# Altium schematic sheet Solar Batter Charger SCH_2.SchDoc
size A3; SheetNumber: 3; SheetTotal: 3
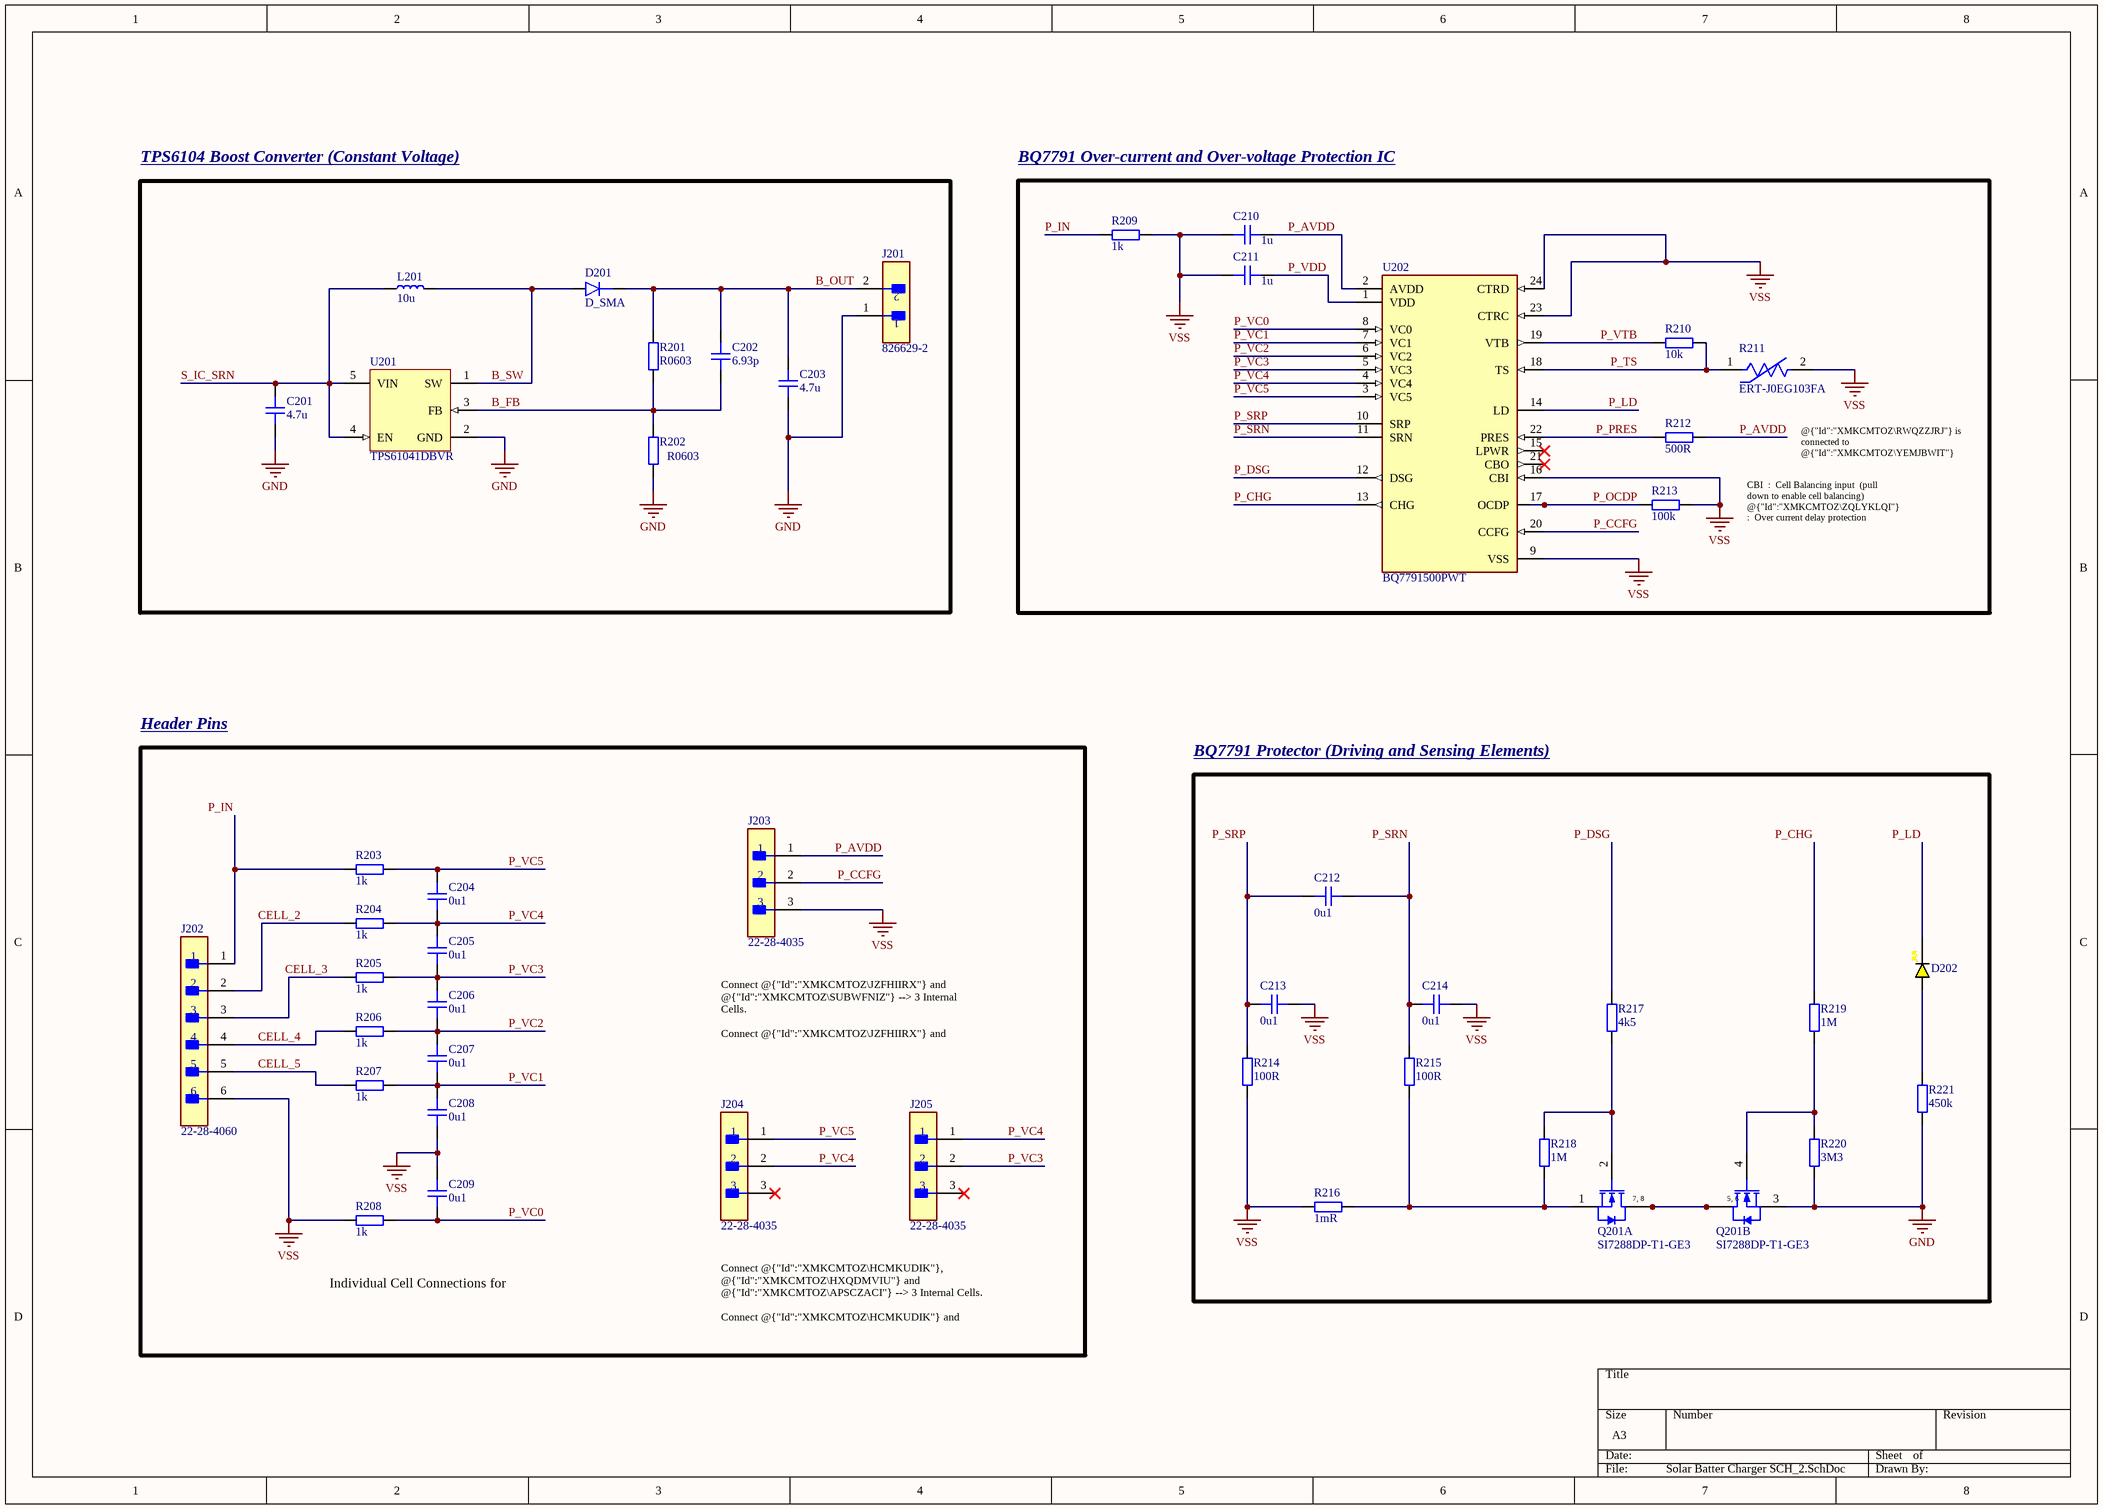
[diagram p0: Solar Batter Charger SCH_2.SchDoc]

## Parts
C201  4.7u  [CAP_1210]
C202  6.93p  [CAP_0805]
C203  4.7u  [CAP_1210]
C204  0u1  [CAP_0603]
C205  0u1  [CAP_0603]
C206  0u1  [CAP_0603]
C207  0u1  [CAP_0603]
C208  0u1  [CAP_0603]
C209  0u1  [CAP_0603]
C210  1u  [CAP_0603]
C211  1u  [CAP_0603]
C212  0u1  [CAP_0603]
C213  0u1  [CAP_0603]
C214  0u1  [CAP_0603]
D201  D_SMA  [DO-214AC-2 (SMA)]
D202  YELLOW  [LED_0603_YELLOW]  (value not drawn)
J201  826629-2  [FP-826629-2-MFG]
J202  22-28-4060  [FP-22-28-4060-MFG]
J203  22-28-4035  [FP-22-28-4035-MFG]
J204  22-28-4035  [FP-22-28-4035-MFG]
J205  22-28-4035  [FP-22-28-4035-MFG]
L201  10u  [NRS5020]
Q201  SI7288DP-T1-GE3  [VISH-POWERPAKSO-8_A_V]  (parts A,B of 2)
R201  R0603  [RES_0603]
R202  R0603  [RES_0603]
R203  1k  [RES_0603]
R204  1k  [RES_0603]
R205  1k  [RES_0603]
R206  1k  [RES_0603]
R207  1k  [RES_0603]
R208  1k  [RES_0603]
R209  1k  [RES_0603]
R210  10k  [RES_0402]
R211  ERT-J0EG103FA  [FP-ERTJ0-MFG]
R212  500R  [RES_0402]
R213  100k  [RES_0805]
R214  100R  [RES_0402]
R215  100R  [RES_0402]
R216  1mR  [RES_0603]
R217  4k5  [RES_0805]
R218  1M  [RES_0805]
R219  1M  [RES_0805]
R220  3M3  [RES_0805]
R221  450k  [RES_0805]
U201  TPS61041DBVR  [DBV0005A_M]
U202  BQ7791500PWT  [FP-PW0024A-MFG]

## Blocks framed on the sheet
TPS6104 Boost Converter (Constant Voltage): C201-C203 D201 J201 L201 R201 R202 U201
BQ7791 Over-current and Over-voltage Protection IC: C210 C211 R209-R213 U202
Header Pins: C204-C209 J202-J205 R203-R208
BQ7791 Protector (Driving and Sensing Elements): C212-C214 D202 Q201 R214-R221

## Nets
GND: C201.1 C203.1 J201.1 Q201.3(S2) R202.1 R220.1 R221.1 U201.2(GND)
VSS: C208.2 C209.1 C210.1 C211.1 C213.2 C214.2 J202.6 J203.3 R208.1 R209.2 R211.2 R213.2 R214.1 R216.2 U202.9(VSS) U202.16(CBI) U202.23(CTRC) U202.24(CTRD)
B_FB: C202.2 R201.1 R202.2 U201.3(FB)
B_OUT: C202.1 C203.2 D201.K J201.2 R201.2
B_SW: D201.A L201.2 U201.1(SW)
CELL_2: J202.2 R204.1
CELL_3: J202.3 R205.1
CELL_4: J202.4 R206.1
CELL_5: J202.5 R207.1
P_AVDD: C210.2 J203.1 R212.2 U202.2(AVDD)
P_CCFG: J203.2 U202.20(CCFG)
P_CHG: R219.2 U202.13(CHG)
P_DSG: R217.2 U202.12(DSG)
P_IN: J202.1 R203.1 R209.1
P_LD: D202.K U202.14(LD)
P_OCDP: R213.1 U202.17(OCDP)
P_PRES: R212.1 U202.22(PRES)
P_SRN: C212.2 C214.1 R215.2 U202.11(SRN)
P_SRP: C212.1 C213.1 R214.2 U202.10(SRP)
P_TS: R210.2 R211.1 U202.18(TS)
P_VC0: C209.2 R208.2 U202.8(VC0)
P_VC1: C207.2 C208.1 R207.2 U202.7(VC1)
P_VC2: C206.2 C207.1 R206.2 U202.6(VC2)
P_VC3: C205.2 C206.1 J205.2 R205.2 U202.5(VC3)
P_VC4: C204.2 C205.1 J204.2 J205.1 R204.2 U202.4(VC4)
P_VC5: C204.1 J204.1 R203.2 U202.3(VC5)
P_VDD: C211.2 U202.1(VDD)
P_VTB: R210.1 U202.19(VTB)
S_IC_SRN: C201.2 L201.1 U201.4(EN) U201.5(VIN)
NetD202_A: D202.A R221.2
NetQ201_1: Q201.1(S1) R215.1 R216.1 R218.1
NetQ201_2: Q201.2(G1) R217.1 R218.2
NetQ201_4: Q201.4(G2) R219.1 R220.2
NetQ201_5: Q201.5(D2) Q201.6(D2) Q201.7(D1) Q201.8(D1)

Not connected (* = marked no-connect by the designer): J204 3*; J205 3*; U202 15(LPWR)* 21(CBO)*

## Notes on the sheet
- @{"Id":"XMKCMTOZ\RWQZZJRJ"} is connected to @{"Id":"XMKCMTOZ\YEMJBWIT"} through a pull up resistor, so it will ALWAYS operate in NORMAL mode.
- CBI  :  Cell Balancing input  (pull down to enable cell balancing)
  @{"Id":"XMKCMTOZ\ZQLYKLQI"}  :  Over current delay protection
- Connect @{"Id":"XMKCMTOZ\JZFHIIRX"} and @{"Id":"XMKCMTOZ\SUBWFNIZ"} --> 3 Internal Cells.
  Connect @{"Id":"XMKCMTOZ\JZFHIIRX"} and @{"Id":"XMKCMTOZ\YEMJBWIT"} --> 4 Internal Cells.
  @{"Id":"XMKCMTOZ\JZFHIIRX"} is floating --> 5 Internal Cells
- Individual Cell Connections for Balanced Charging
- Connect @{"Id":"XMKCMTOZ\HCMKUDIK"}, @{"Id":"XMKCMTOZ\HXQDMVIU"} and @{"Id":"XMKCMTOZ\APSCZACI"} --> 3 Internal Cells.
  Connect @{"Id":"XMKCMTOZ\HCMKUDIK"} and @{"Id":"XMKCMTOZ\HXQDMVIU"} --> 4 Internal Cells.
  No Jumpers are connected --> 5 Internal Cells
- (in symbol CMP-2000-07062-1, part A) 7, 8
- (in symbol CMP-2000-07062-1, part B) 5, 6

## Library data of the parts
C201 C203 = CAP_1210: Capacitor SMD 1210; Manufacturer: *; Manufacturer Part Number: *; Distributor Link: *; LCSC: *; Rating: *; Dielectric: *
C202 = CAP_0805: Capacitor SMD 0805; Manufacturer: *; Manufacturer Part Number: *; Distributor Link: *; LCSC: *; Rating: *; Dielectric: *
C204-C214 = CAP_0603: Capacitor SMD 0603; Manufacturer: *; Manufacturer Part Number: *; Distributor Link: *; LCSC: *; Rating: *; Dielectric: *
D201 = D_SMA: Diode SMD SMA (DO-214AA)
D202 = LED_0603_YELLOW: LED 0603 YELLOW SMD
J201 = CMP-05178-000003-1: CONN HEADER VERT 2POS 2.54MM; RoHS Compliant: Yes
J202 = CMP-04776-000763-1: CONN HEADER VERT 6POS 2.54MM; Voltage Rating: 250V; Current Rating: 4A; Number of Contacts: 6; Max Voltage Rating (DC): 250.25kV; Gender: Male; Contact Resistance: 20mR; Connector Type: Male Pin; Color: Black; Max Voltage Rating (AC): 250V; Pitch: 2.54mm; Orientation: Straight; Max Operating Temperature: 75°C; Contact Plating: Tin; Depth: 2.49mm; Contact Type: Male Pin; Number of Positions: 6; Length: 15.24mm; Packaging: Bulk; Mount: Through Hole; Housing Material: Thermoplastic; Housing Color: Black; Termination: Solder; Contact Material: Brass; Min Operating Temperature: 0°C; Series: KK® 42375; Number of Rows: 1; Package Quantity: 1; RoHS Compliant: Yes; Contact Mating Length: 0.24inch
J203-J205 = CMP-00257-00247547-1: 22-28-4035 BOARD-BOARD Connector HEADER, 3WAY, 1ROW; Series: KK; Pitch Spacing: 2.54mm; No. of Rows: 1;; Manufacturer Lifecycle Status: ACTIVE; NexarPartId: 247547; Plating: Tin; Max Voltage Rating (DC): 250.25kV; Voltage Rating: 250V; Current Rating: 4A; Gender: Male; Glow Wire Compliant: Non-compliant; Number of Positions: 3; Connector Type: Male Pin; Contact Resistance: 20mΩ; Color: Black; Contact Plating: Gold; Contact Material: Brass; Lead Free: Lead Free; Number of Rows: 1; Housing Material: Thermoplastic; Min Operating Temperature: 0°C; Country of Origin: US; REACH SVHC: Unknown; Lifecycle Status: Production; Mount: Through Hole; Schedule B: 8536694040; RoHS: Compliant; Termination: Through Hole; Max Operating Temperature: 75°C; Pitch: 2.54mm; Packaging: Bulk; Number of Circuits: 3; Contact Mating Length: 7.493mm; Orientation: Vertical; Housing Color: Black; Number of Contacts: 3
L201 = NRS5020: NRS5020 SMD Power Inductor Taiyo Yuden; Manufacturer: Taiyo Yuden; Manufacturer Part Number: NRS5020
Q201 = CMP-2000-07062-1: Dual N-Channel (D-S) MOSFET, 40 V, 20 A, -55 to 150 degC, 8-Pin POWERPAKSO-8, RoHS, Tape and Reel; Manufacturer: Vishay; Gate Charge (Qg) @ Vgs: 15nC@10V; FET Feature: Standard; Rds On (Max) @ Id, Vgs: 19mOhm@10A,10V; Drain to Source Voltage (Vdss): 40V; Other Names: SI7288DP-T1-GE3DKR; Online Catalog: N-ChannelStandardFETs; Power - Max: 15.6W; PCN Assembly/Origin: MultipleFabracationChanges09/Jul/2014; Input Capacitance (Ciss) @ Vds: 565pF@20V; Current - Continuous Drain (Id) @ 25°C: 20A; Vgs(th) (Max) @ Id: 2.8V@250µA; FET Type: 2N-Channel(Dual); Package Reference: POWERPAKSO-8; Datasheet URL: http://www.vishay.com/docs/65366/si7288dp.pdf; Package Description: 8-Pin Surface Mount Device, Body 6.15 x 5.155 mm, Pitch 1.27 mm; Manufacturer URL: http://www.vishay.com/; Package / Case: PowerPAK®SO-8Dual; Category: DiscreteSemiconductorProducts; Mounting Type: SurfaceMount; Standard Package: 1; Mounting Technology: SurfaceMount; Series: TrenchFET®; Datasheet Version: Rev. A, 10/2009; Supplier Device Package: PowerPAK®SO-8Dual; Family: FETs-Arrays; Packaging: Digi-Reel®
R201-R209 R216 = RES_0603: Resistor SMD 0603; Manufacturer: *; Manufacturer Part Number: *; Distributor Link: *; LCSC: *
R210 R212 R214 R215 = RES_0402: Resistor SMD 0402; Manufacturer: *; Manufacturer Part Number: *; Distributor Link: *; LCSC: *
R211 = CMP-2002-01179-2: THERMISTOR NTC 10KOHM 3380K 0402; Power Rating: 66mW; Accuracy: 1%; Resistance: 10kR; Mount: Surface Mount; Radiation Hardening: No; Case Code (Metric): 1005; Termination: SMD/SMT; Width: 500um; Packaging: Tape and Reel; Case Code (Imperial): 0402; Depth: 0.5mm; Max Operating Temperature: 125°C; REACH SVHC: No SVHC; Case/Package: 0402; RoHS Compliant: Yes; Lead Free: Lead Free; Package Quantity: 1; Min Operating Temperature: -40°C; Tolerance: 1%; Resistance Tolerance: 1%; Height: 0.5mm; Contact Plating: Tin; Series: ERT-J; Max Power Dissipation: 66mW; Number of Pins: 2; Length: 1mm
R213 R217-R221 = RES_0805: Resistor SMD 0805; Manufacturer: *; Manufacturer Part Number: *; Distributor Link: *; LCSC: *
U201 = CMP-0388-00116-2: 28 V, 250 mA Switch Boost Converter for LCD and White LED Applications, 1.8 to 6 V, -40 to 85 degC, 5-pin SOT23 (DBV5), Green (RoHS & no Sb/Br); Manufacturer: Texas Instruments; SubFamily: White LED Driver; Vin(Max)(V): 6; Rating: Catalog; Switching Frequency(Max)(kHz): 1000; Dimming: TRUE; Iq(Typ)(mA): 0.028; Vin(Min)(V): 1.8; Iout(Max)(A): 0.05; PackageVersion: 4073253-4/K; PackageDescription: 5-Pin Plastic Small Outline, Body 1.60 Ãƒâ€” 2.90 mm, Pitch 0.95 mm; Mounting Technology: Surface Mount; Topology: Boost; ComponentLink2Description: Datasheet; DatasheetVersion: SLVS413F; ComponentLink3URL: http://www.ti.com/litv/pdf/mpds018i; ComponentLink3Description: Package Specification; Code_JEDEC: MO-178; Eco-Plan: Green (RoHS & no Sb/Br); ComponentLink1URL: http://www.ti.com/; ComponentLink2URL: http://www.ti.com/general/docs/lit/getliterature.tsp?genericPartNumber=TPS61041&fileType=pdf; PackageReference: DBV0005A; PartNumber: TPS61041DBVR; ComponentLink1Description: Manufacturer URL
U202 = CMP-04911-000012-1: 3-SERIES TO 5-SERIES STACKABLE U; Manufacturer: Texas Instruments; Output Voltage: 0-25V; Min Supply Voltage: 3V; Max Supply Voltage: 25V; Output Current: 50mA; Number Of Cells: 5; Nominal Supply Current: 8-48uA; Standoff Height: 0.05mm; Octopart: https://octopart.com/bq7791500pwt-texas+instruments-90752675; Temperature Range High: +85°C; Height: 1.2mm; ComponentLink2URL: http://www.ti.com/lit/ds/symlink/bq77915.pdf; Temperature Range Low: -40°C; Manufacturer Part Number: BQ7791500PWT; Temperature: -40°C to +85°C; Digikey Description: 3-SERIES TO 5-SERIES STACKABLE U; Device Class L2: Power Management ICs; Lead Free: Yes; Automotive: No; Device Class L3: Battery Management; Package: PW0024A; ComponentLink2Description: Datasheet; Category: IC; RoHS: TRUE; Device Class L1: Integrated Circuits (ICs)